# Altium project ADAPTONE_CARTE_DE_SON.PrjPCB (part 3 of 3)

## Sheet StereoHeadphoneDriver.SchDoc
size Tabloid; Size: 11x17; Sheet_Name: Stereo Headphone Driver
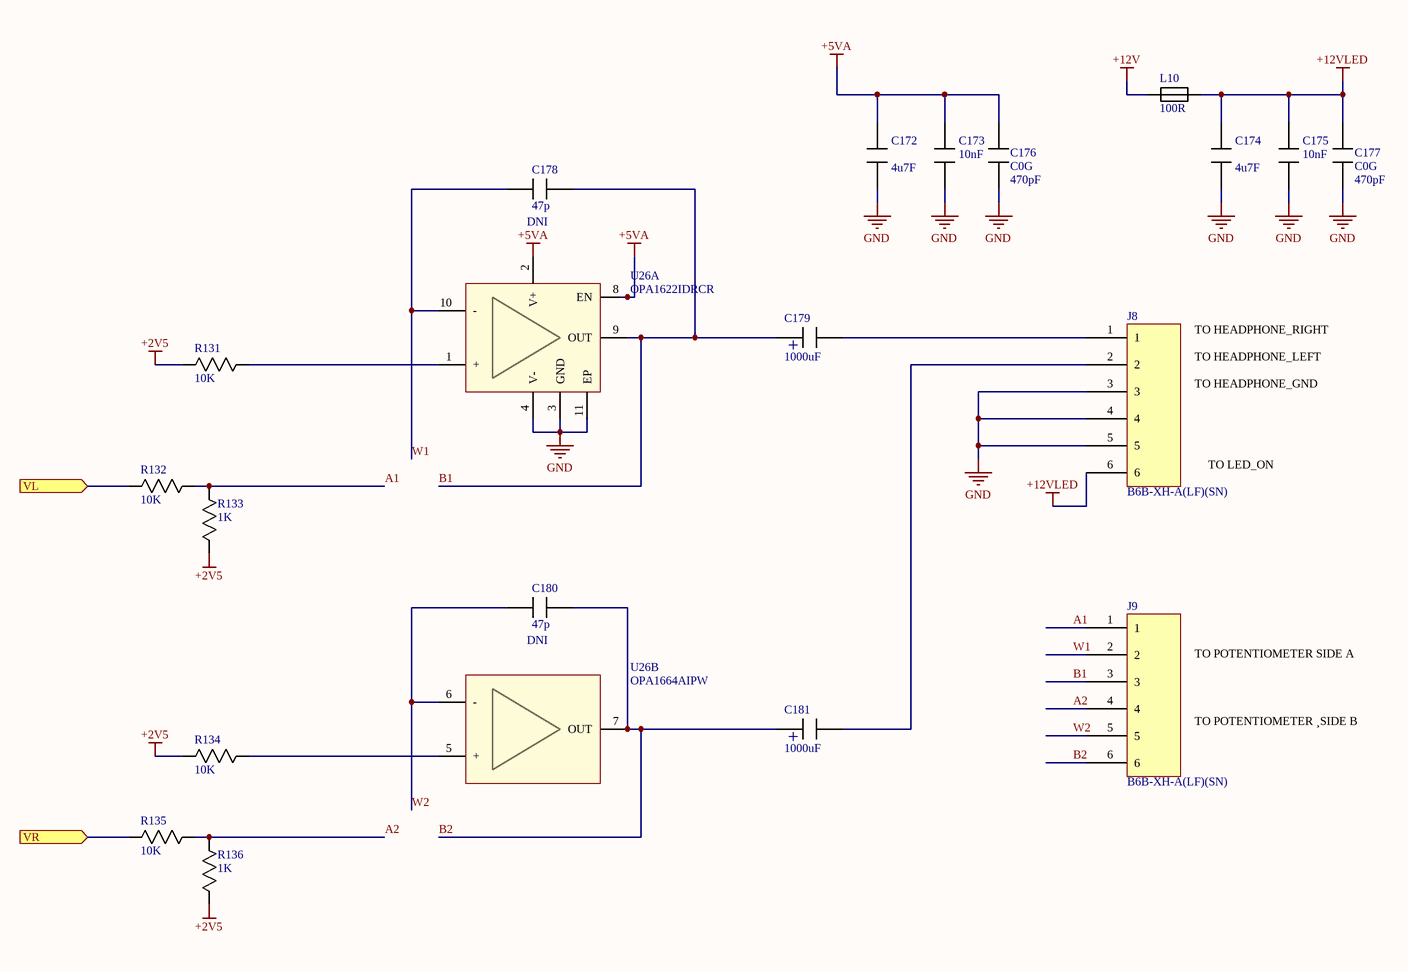
[diagram p12: StereoHeadphoneDriver.SchDoc]

### Parts
C172  value 4u7F  [0805]  (hidden comment: Capacitor)
C173  value 10nF  [0603]  (hidden comment: Capacitor)
C174  value 4u7F  [0805]  (hidden comment: Capacitor)
C175  value 10nF  [0603]  (hidden comment: Capacitor)
C176  value 470pF  Type: C0G  [0603]  (hidden comment: Capacitor)
C177  value 470pF  Type: C0G  [0603]  (hidden comment: Capacitor)
C178  value 47p  note: DNI  [0402]  (hidden comment: Capacitor)
C179  value 1000uF  [CAP_RAD_SMD_DIA315]  (hidden comment: Capacitor_Polarized)
C180  value 47p  note: DNI  [0402]  (hidden comment: Capacitor)
C181  value 1000uF  [CAP_RAD_SMD_DIA315]  (hidden comment: Capacitor_Polarized)
J8  Mfg_PN: B6B-XH-A(LF)(SN)  [CONN_6_HEADER]  (hidden comment: CON_XH_JST_6pins)
J9  Mfg_PN: B6B-XH-A(LF)(SN)  [CONN_6_HEADER]  (hidden comment: CON_XH_JST_6pins)
L10  value 100R  [0603]  (hidden comment: Ferrite)
R131  value 10K  [0402]  (hidden comment: Resistor)
R132  value 10K  [0402]  (hidden comment: Resistor)
R133  value 1K  [0402]  (hidden comment: Resistor)
R134  value 10K  [0402]  (hidden comment: Resistor)
R135  value 10K  [0402]  (hidden comment: Resistor)
R136  value 1K  [0402]  (hidden comment: Resistor)
U26  Mfg_PN: OPA1622IDRCR  [10-VFDFN]  (hidden comment: OPA1622)  (parts A,B of 2)

### Ports
VL (in), VR (in)

### Nets
+2V5: R131.2 R133.2 R134.2 R136.2
+5VA: C172.1 C173.1 C176.2 U26.2(V+) U26.8(EN)
+12V: L10.1
+12VLED: C174.1 C175.1 C177.2 J8.6 L10.2
GND: C172.2 C173.2 C174.2 C175.2 C176.1 C177.1 J8.3 J8.4 J8.5 U26.3(GND) U26.4(V-) U26.11(EP)
A1: J9.1 R132.1 R133.1
A2: J9.4 R135.1 R136.1
B1: C178.2 C179.+ J9.3 U26.9(OUT)
B2: C180.2 C181.+ J9.6 U26.7(OUT)
W1: C178.1 J9.2 U26.10(-)
W2: C180.1 J9.5 U26.6(-)
NetC128.8_2: R132.2 ; port VL
NetC138.8_2: R135.2 ; port VR
NetC179_-: C179.- J8.1
NetC181_-: C181.- J8.2
NetR131_1: R131.1 U26.1(+)
NetR134_1: R134.1 U26.5(+)

### Notes on the sheet
- TO HEADPHONE_RIGHT
- TO HEADPHONE_LEFT
- TO HEADPHONE_GND
- TO LED_ON
- TO POTENTIOMETER SIDE A
- TO POTENTIOMETER ¸SIDE B
- Sheet Name
- Project Title
- Size
- Group
- Revision
- Date :
- Filename :
- Sheet
- Authors :
- of

### Library data of the parts
C172 C174 = Capacitor: Mfg: Samsung; Mfg_PN: CL21A475KAQNNNG; HelpURL: *; NI: *; Supplier1: Digikey; Supplier1_PN: 1276-6462-1-ND; Tolerance: *; Type: *; Rating: *
C173 C175 = Capacitor: Mfg: Murata; Mfg_PN: CL05B103KO5NNNC; HelpURL: *; NI: *; Supplier1: Digikey; Supplier1_PN: 1276-1051-1-ND; Tolerance: *; Type: *; Rating: *
C176 C177 = Capacitor: Mfg: Samsung; Mfg_PN: CL10C471JB8NCNC; HelpURL: *; NI: *; Supplier1: Digikey; Supplier1_PN: 1276-2302-1-ND; Tolerance: *; Rating: *
C178 C180 = Capacitor: Mfg: Murata; Mfg_PN: GRM1885C1H222JA01D; HelpURL: *; NI: *; Supplier1: Digikey; Supplier1_PN: 490-1459-1-ND; Tolerance: *; Type: *; Rating: *
C179 = Capacitor_Polarized_1: Capacitor; Mfg: Nichicon; Mfg_PN: UWT0J102MNL1GS; HelpURL: *; NI: *; Supplier1: Digikey; Supplier1_PN: 493-2160-1-ND; Tolerance: *; Type: *; Rating: *
C181 = Capacitor_Polarized_1: Capacitor; Mfg: Nichicon; Mfg_PN: UWT1E221MNL1GS; HelpURL: *; NI: *; Supplier1: Digikey; Supplier1_PN: 493-2192-1-ND; Tolerance: *; Type: *; Rating: *
J8 J9 = CON_XH_JST_6pins: Mfg: JST Sales America Inc.; Supplier1: Digikey
L10 = Ferrite: Mfg: Bourns; Mfg_PN: MH2029-101Y; Rating: 1A; HelpURL: *; NI: *; Supplier1: Digikey; Supplier1_PN: MH2029-101YCT-ND; Tolerance: *; Type: *
R131-R136 = Resistor: Mfg: Yageo; Mfg_PN: 311-10GRCT-ND; HelpURL: *; NI: *; Supplier1: Digikey; Supplier1_PN: 311-100KGRCT-ND; Type: *; Rating: *; Tolerance: *
U26 = OPA1622: Dual amplifier (headphone driver); Mfg: Texas Instruments; HelpURL: *; NI: *; Rating: *; Supplier1: Digikey; Supplier1_PN: 296-45038-1-ND; Tolerance: *; Value: *

## Sheet PHY_ETHERNET.SchDoc
size Tabloid; DrawnBy: Émile Laplante; Size: 11x17; Sheet_Name: Phy ethernet
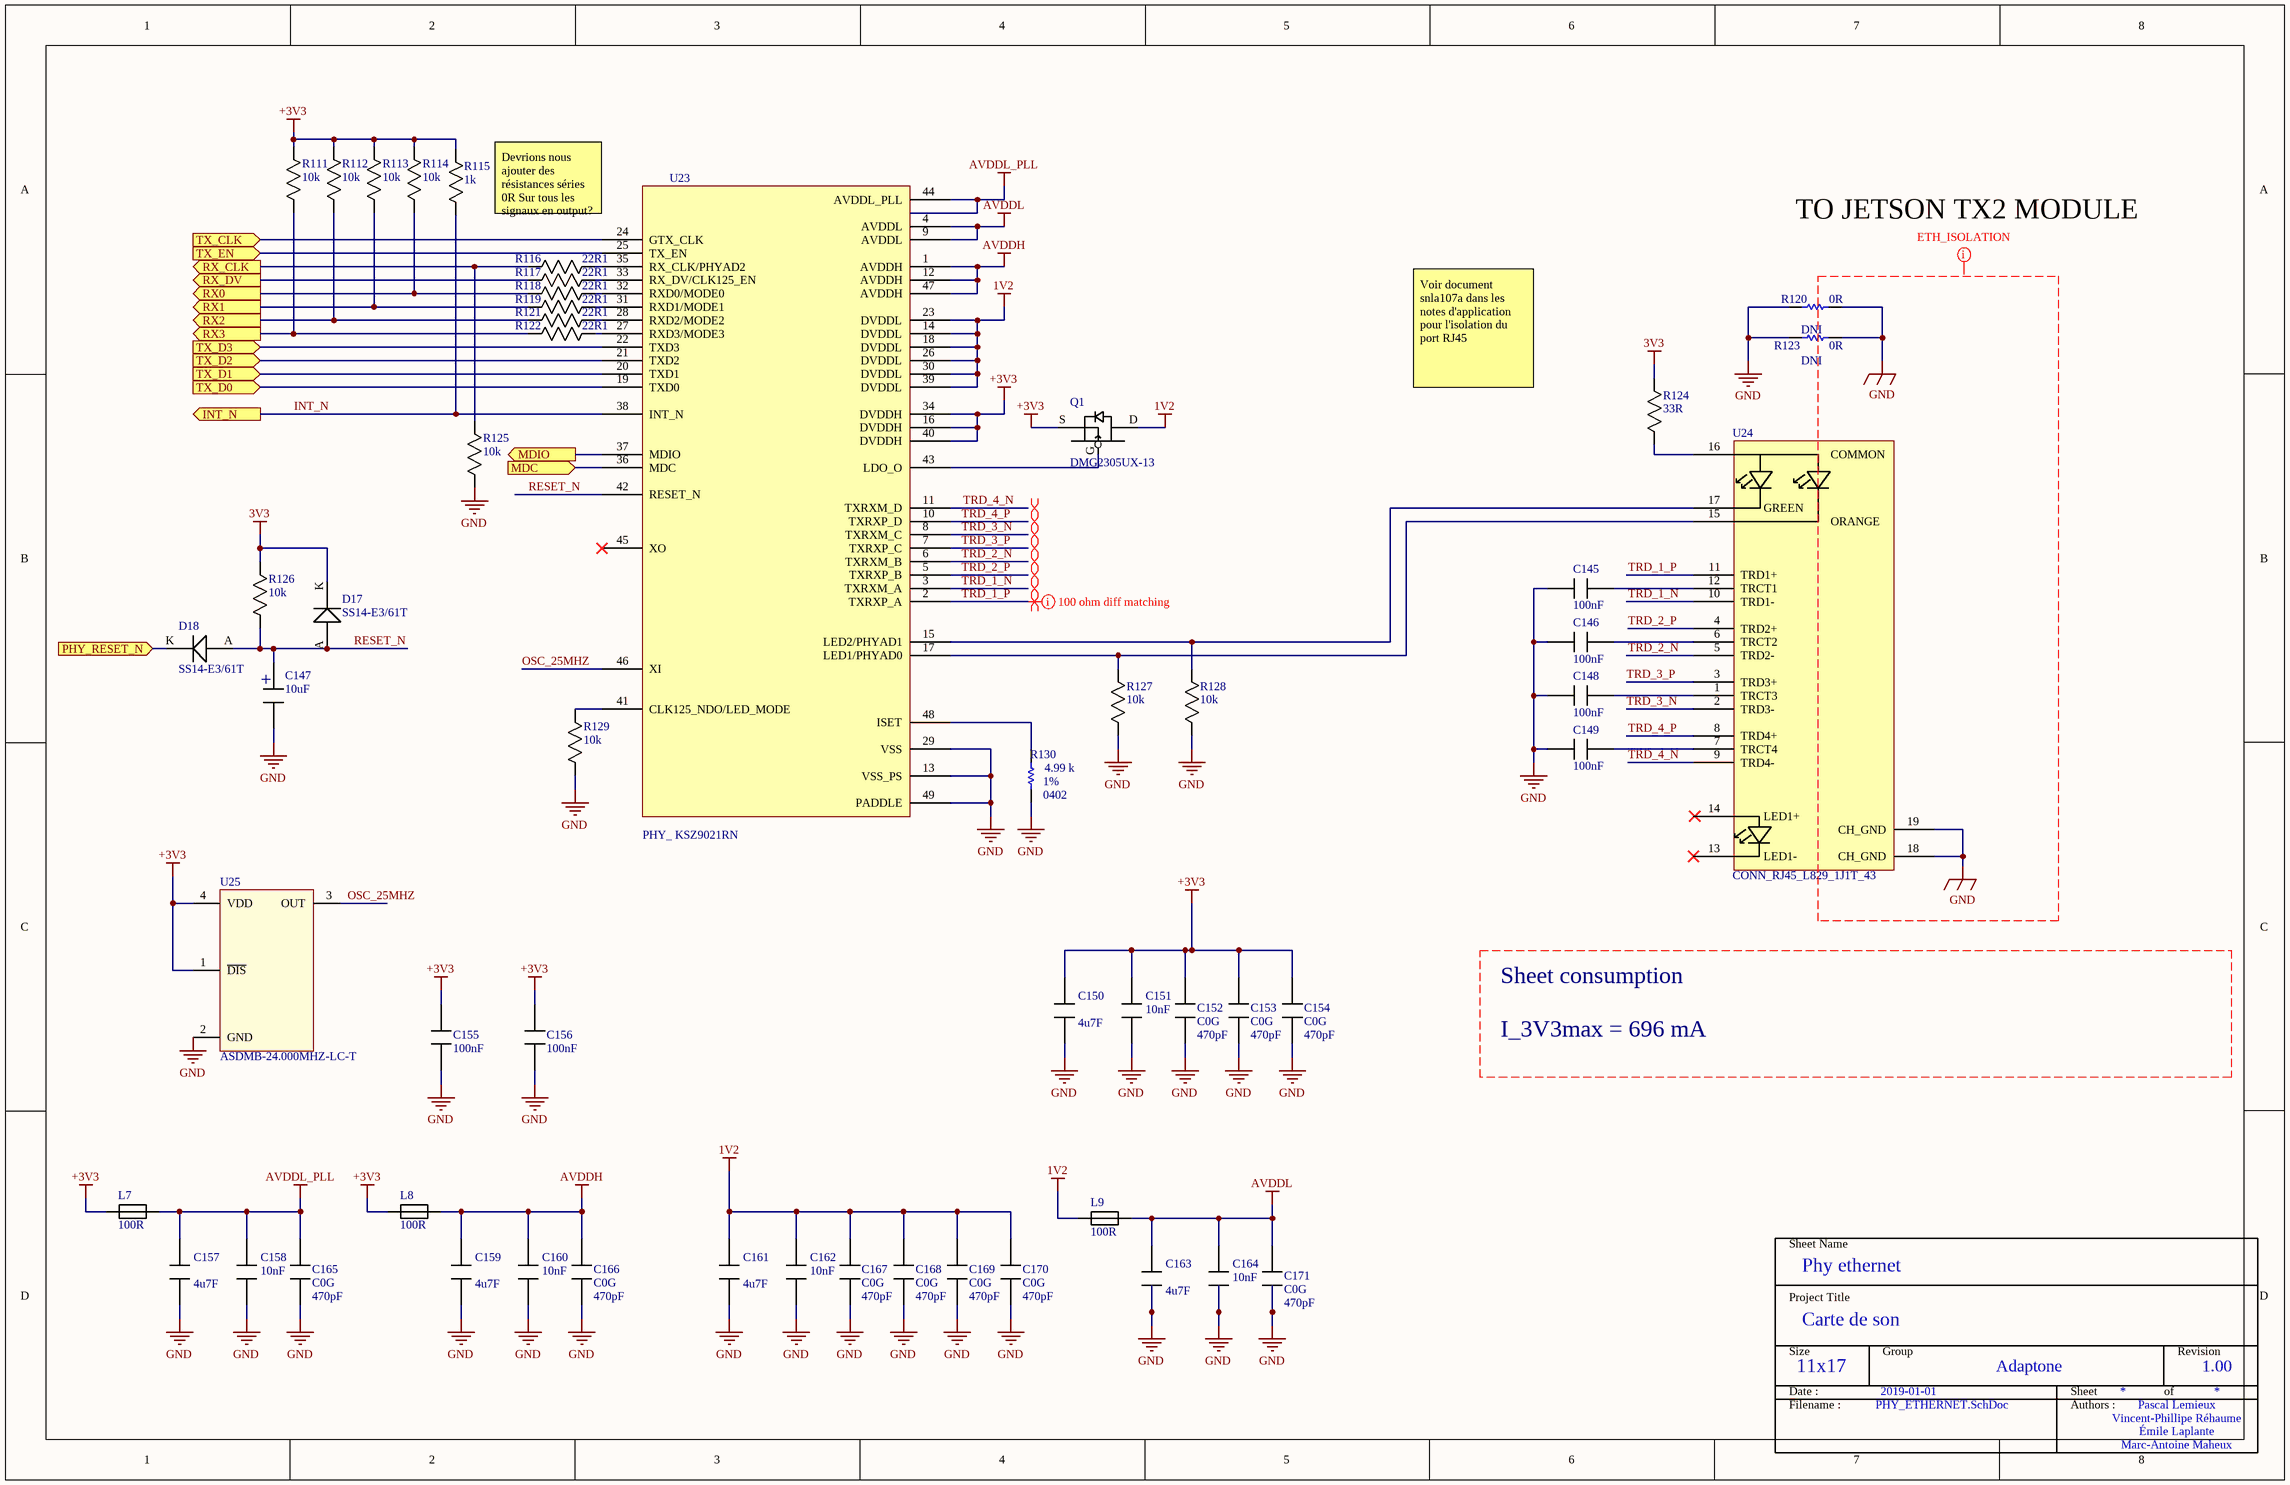
[diagram p13: PHY_ETHERNET.SchDoc]

### Parts
C145  value 100nF  [0603]  (hidden comment: Capacitor)
C146  value 100nF  [0603]  (hidden comment: Capacitor)
C147  value 10uF  [CAP_RAD_SMD_DIA157]  (hidden comment: Capacitor_Polarized)
C148  value 100nF  [0603]  (hidden comment: Capacitor)
C149  value 100nF  [0603]  (hidden comment: Capacitor)
C150  value 4u7F  [0805]  (hidden comment: Capacitor)
C151  value 10nF  [0603]  (hidden comment: Capacitor)
C152  value 470pF  Type: C0G  [0603]  (hidden comment: Capacitor)
C153  value 470pF  Type: C0G  [0603]  (hidden comment: Capacitor)
C154  value 470pF  Type: C0G  [0603]  (hidden comment: Capacitor)
C155  value 100nF  [0603]  (hidden comment: Capacitor)
C156  value 100nF  [0603]  (hidden comment: Capacitor)
C157  value 4u7F  [0805]  (hidden comment: Capacitor)
C158  value 10nF  [0603]  (hidden comment: Capacitor)
C159  value 4u7F  [0805]  (hidden comment: Capacitor)
C160  value 10nF  [0603]  (hidden comment: Capacitor)
C161  value 4u7F  [0805]  (hidden comment: Capacitor)
C162  value 10nF  [0603]  (hidden comment: Capacitor)
C163  value 4u7F  [0805]  (hidden comment: Capacitor)
C164  value 10nF  [0603]  (hidden comment: Capacitor)
C165  value 470pF  Type: C0G  [0603]  (hidden comment: Capacitor)
C166  value 470pF  Type: C0G  [0603]  (hidden comment: Capacitor)
C167  value 470pF  Type: C0G  [0603]  (hidden comment: Capacitor)
C168  value 470pF  Type: C0G  [0603]  (hidden comment: Capacitor)
C169  value 470pF  Type: C0G  [0603]  (hidden comment: Capacitor)
C170  value 470pF  Type: C0G  [0603]  (hidden comment: Capacitor)
C171  value 470pF  Type: C0G  [0603]  (hidden comment: Capacitor)
D17  Mfg_PN: SS14-E3/61T  [DIODE_SMA]  (hidden comment: Diode)
D18  Mfg_PN: SS14-E3/61T  [DIODE_SMA]  (hidden comment: Diode)
L7  value 100R  [0603]  (hidden comment: Ferrite)
L8  value 100R  [0603]  (hidden comment: Ferrite)
L9  value 100R  [0603]  (hidden comment: Ferrite)
Q1  Mfg_PN: DMG2305UX-13  [SOT23_GDS]  (hidden comment: MOSFET_P_GDS)
R111  value 10k  [0603]  (hidden comment: Resistor)
R112  value 10k  [0603]  (hidden comment: Resistor)
R113  value 10k  [0603]  (hidden comment: Resistor)
R114  value 10k  [0603]  (hidden comment: Resistor)
R115  value 1k  [0603]  (hidden comment: Resistor)
R116  value 22R1  [0402]  (hidden comment: Resistor)
R117  value 22R1  [0402]  (hidden comment: Resistor)
R118  value 22R1  [0402]  (hidden comment: Resistor)
R119  value 22R1  [0402]  (hidden comment: Resistor)
R120  value 0R  Specification: DNI  [RES_1206]  (hidden comment: RES - 1206)
R121  value 22R1  [0402]  (hidden comment: Resistor)
R122  value 22R1  [0402]  (hidden comment: Resistor)
R123  value 0R  Specification: DNI  [RES_1206]  (hidden comment: RES - 1206)
R124  value 33R  [0603]  (hidden comment: Resistor)
R125  value 10k  [0603]  (hidden comment: Resistor)
R126  value 10k  [0603]  (hidden comment: Resistor)
R127  value 10k  [0603]  (hidden comment: Resistor)
R128  value 10k  [0603]  (hidden comment: Resistor)
R129  value 10k  [0603]  (hidden comment: Resistor)
R130  value 4.99 k  Package: 0402  Precision: 1%  [RES_0402]  (hidden comment: RES - 0402)
U23  PHY_ KSZ9021RN  [PHY_KSZ9021RN]
U24  CONN_RJ45_L829_1J1T_43  [L829-1J1T-43]
U25  Mfg_PN: ASDMB-24.000MHZ-LC-T  [OSC_ADSMB]  (hidden comment: OSC_ASDMB)

### Ports
INT_N (out), MDC (in), MDIO (out), PHY_RESET_N (in), RX0 (out), RX1 (out), RX2 (out), RX3 (out), RX_CLK (out), RX_DV (out), TX_CLK (in), TX_D0 (in), TX_D1 (in), TX_D2 (in), TX_D3 (in), TX_EN (in)

### Nets
1V2: C161.1 C162.1 C167.2 C168.2 C169.2 C170.2 L9.1 Q1.D U23.14(DVDDL) U23.18(DVDDL) U23.23(DVDDL) U23.26(DVDDL) U23.30(DVDDL) U23.39(DVDDL)
3V3: D17.K R124.2 R126.2
+3V3: C150.1 C151.1 C152.2 C153.2 C154.2 C155.1 C156.1 L7.1 L8.1 Q1.S R111.1 R112.1 R113.1 R114.1 R115.2 U23.16(DVDDH) U23.34(DVDDH) U23.40(DVDDH) U25.1(~{DIS}) U25.4(VDD)
AVDDH: C159.1 C160.1 C166.2 L8.2 U23.1(AVDDH) U23.12(AVDDH) U23.47(AVDDH)
AVDDL: C163.1 C164.1 C171.2 L9.2 U23.4(AVDDL) U23.9(AVDDL)
AVDDL_PLL: C157.1 C158.1 C165.2 L7.2 U23.44(AVDDL_PLL)
GND: C145.2 C146.2 C147.- C148.2 C149.2 C150.2 C151.2 C152.1 C153.1 C154.1 C155.2 C156.2 C157.2 C158.2 C159.2 C160.2 C161.2 C162.2 C163.2 C164.2 C165.1 C166.1 C167.1 C168.1 C169.1 C170.1 C171.1 R120.1 R120.2 R123.1 R123.2 R125.2 R127.2 R128.2 R129.2 R130.1 U23.13(VSS_PS) U23.29(VSS) U23.49(PADDLE) U24.18(CH_GND) U24.19(CH_GND) U25.2(GND)
INT_N: R115.1 U23.38(INT_N) ; port INT_N
OSC_25MHZ: U23.46(XI) U25.3(OUT)
PHY_MDC: U23.36(MDC) ; port MDC
PHY_MDIO: U23.37(MDIO) ; port MDIO
PHY_RESET_N: D18.K ; port PHY_RESET_N
PHY_RX0: R114.2 R118.1 ; port RX0
PHY_RX1: R113.2 R119.1 ; port RX1
PHY_RX2: R112.2 R121.1 ; port RX2
PHY_RX3: R111.2 R122.1 ; port RX3
PHY_RX_CLK: R116.1 R125.1 ; port RX_CLK
PHY_RX_DV: R117.1 ; port RX_DV
PHY_TX_CLK: U23.24(GTX_CLK) ; port TX_CLK
PHY_TX_D0: U23.19(TXD0) ; port TX_D0
PHY_TX_D1: U23.20(TXD1) ; port TX_D1
PHY_TX_D3: U23.22(TXD3) ; port TX_D3
PHY_TX_EN: U23.25(TX_EN) ; port TX_EN
PHY_TXD2: U23.21(TXD2) ; port TX_D2
RESET_N: C147.+ D17.A D18.A R126.1 U23.42(RESET_N)
TRD_1_N: U23.3(TXRXM_A) U24.10(TRD1-)
TRD_1_P: U23.2(TXRXP_A) U24.11(TRD1+)
TRD_2_N: U23.6(TXRXM_B) U24.5(TRD2-)
TRD_2_P: U23.5(TXRXP_B) U24.4(TRD2+)
TRD_3_N: U23.8(TXRXM_C) U24.2(TRD3-)
TRD_3_P: U23.7(TXRXP_C) U24.3(TRD3+)
TRD_4_N: U23.11(TXRXM_D) U24.9(TRD4-)
TRD_4_P: U23.10(TXRXP_D) U24.8(TRD4+)
NetC145_1: C145.1 U24.12(TRCT1)
NetC146_1: C146.1 U24.6(TRCT2)
NetC148_1: C148.1 U24.1(TRCT3)
NetC149_1: C149.1 U24.7(TRCT4)
NetQ1_G: Q1.G U23.43(LDO_O)
NetR116_2: R116.2 U23.35(RX_CLK/PHYAD2)
NetR117_2: R117.2 U23.33(RX_DV/CLK125_EN)
NetR118_2: R118.2 U23.32(RXD0/MODE0)
NetR119_2: R119.2 U23.31(RXD1/MODE1)
NetR121_2: R121.2 U23.28(RXD2/MODE2)
NetR122_2: R122.2 U23.27(RXD3/MODE3)
NetR124_1: R124.1 U24.16(COMMON)
NetR127_1: R127.1 U23.17(LED1/PHYAD0) U24.15(ORANGE)
NetR128_1: R128.1 U23.15(LED2/PHYAD1) U24.17(GREEN)
NetR129_1: R129.1 U23.41(CLK125_NDO/LED_MODE)
NetR130_2: R130.2 U23.48(ISET)

Not connected (* = marked no-connect by the designer): U23 45(XO)*; U24 13(LED1-)* 14(LED1+)

### Layout directives
differential pair: TRD_1_N, TRD_1_P, TRD_2_N, TRD_2_P, TRD_3_N, TRD_3_P, TRD_4_N, TRD_4_P
net class TO JETSON TX2 MODULE: GND
rule Undefined: TRD_1_P

### Notes on the sheet
- Devrions nous ajouter des résistances séries 0R Sur tous les signaux en output?
- Voir document snla107a dans les notes d'application pour l'isolation du port RJ45
- Sheet consumption
- I_3V3max = 696 mA
- Sheet Name
- Project Title
- Size
- Group
- Revision
- Date :
- Filename :
- Sheet
- Authors :
- of

### Library data of the parts
C145 C146 C148 C149 C155 C156 = Capacitor: Mfg: Samsung; Mfg_PN: CL10F104ZO8NNNC; HelpURL: *; Supplier1: Digikey; Supplier1_PN: 1276-1258-1-ND; Tolerance: *; Type: *; Rating: *
  C145 C146 C148 C149: NI: NI
  C155 C156: NI: *
C147 = Capacitor_Polarized: Capacitor; Mfg: Nichicon; Mfg_PN: UWX1C100MCL1GB; HelpURL: *; NI: *; Supplier1: Digikey; Supplier1_PN: 493-2100-1-ND; Tolerance: *; Type: *; Rating: *
C150 C157 C159 C161 C163 = Capacitor: Mfg: Samsung; Mfg_PN: CL21A475KAQNNNG; HelpURL: *; NI: *; Supplier1: Digikey; Supplier1_PN: 1276-6462-1-ND; Tolerance: *; Type: *; Rating: *
C151 C158 C160 C162 C164 = Capacitor: Mfg: Murata; Mfg_PN: CL05B103KO5NNNC; HelpURL: *; NI: *; Supplier1: Digikey; Supplier1_PN: 1276-1051-1-ND; Tolerance: *; Type: *; Rating: *
C152-C154 C165-C171 = Capacitor: Mfg: Samsung; Mfg_PN: CL10C471JB8NCNC; HelpURL: *; NI: *; Supplier1: Digikey; Supplier1_PN: 1276-2302-1-ND; Tolerance: *; Rating: *
D17 D18 = Diode: Mfg: Vishay; HelpURL: *; NI: *; Supplier1: Digikey; Supplier1_PN: SS14-E3/61TGICT-ND; Tolerance: *; Type: *; Rating: *; Value: *
L7-L9 = Ferrite: as L10 on sheet StereoHeadphoneDriver; HelpURL: *; NI: *; Supplier1: Digikey; Supplier1_PN: MH2029-101YCT-ND; Tolerance: *; Type: *
Q1 = MOSFET_P_GDS: PMOS; Mfg: Diodes Incorporated; HelpURL: *; NI: *; Rating: *; Supplier1: Digikey; Supplier1_PN: DMG2305UX-13DICT-ND; Tolerance: *; Type: *; Value: *
R111-R114 R125-R129 = Resistor: Mfg: Yageo; Mfg_PN: RC0603JR-0710KL; HelpURL: *; NI: *; Supplier1: Digikey; Supplier1_PN: 311-10KGRCT-ND; Type: *; Rating: *; Tolerance: *
R115 = Resistor: Mfg: Yageo; Mfg_PN: RC0603JR-071KL; HelpURL: *; NI: *; Supplier1: Digikey; Supplier1_PN: 311-1.0KGRCT-ND; Type: *; Rating: *; Tolerance: *
R116-R119 R121 R122 = Resistor: Mfg: Yageo; Mfg_PN: RC0402FR-0722R1L; HelpURL: *; NI: *; Supplier1: Digikey; Supplier1_PN: 311-22.1LRCT-ND; Type: *; Rating: *; Tolerance: *
R120 R123 = RES - 1206: Mfg Part Number: RMCF1206ZT0R00; Mfg: Stackpole Electronics Inc; Precision: 1%; Current: *; HelpURL: https://www.digikey.ca/product-detail/en/stackpole-electronics-inc/RMCF1206ZT0R00/RMCF1206ZT0R00TR-ND/1756906; CreatedBy: Jonathan Bouchard; Package: 1206
R124 = Resistor: Mfg: Yageo; Mfg_PN: RC0603JR-0733RL; HelpURL: *; NI: *; Supplier1: Digikey; Supplier1_PN: 311-33GRCT-ND; Type: *; Rating: *; Tolerance: *
R130 = RES - 0402: Mfg Part Number: RC0402FR-074K99L; Suplier Part Number: 311-4.99KLRCT-ND; Mfg: Yageo; Power: 1/16W; Current: *; HelpURL: https://www.digikey.ca/product-detail/en/yageo/RC0402FR-074K99L/311-4.99KLRCT-ND/2827886; CreatedBy: Jonathan Bouchard; Supplier: Digikey
U23 = PHY_ KSZ9021RN: Mfg: Microchip Technology; CreatedBy: Emile Laplante; HelpURL: https://www.digikey.ca/product-detail/en/microchip-technology/KSZ9021RN/576-3637-ND/2184487; Mfg Part Number: KSZ9021RN; NI: *; Package: 48-VFQFN Exposed Pad; Power: *; Supplier: Digikey; Supplier Part Numer: 576-3637-ND; Temperature: *; Value: *; VerifiedBy: *; Voltage: *
U24 = CONN_RJ45_L829_1J1T_43: Mfg: Bel Fuse Inc.; CreatedBy: Emile Laplante; HelpURL: https://www.digikey.ca/products/en?keywords=L829-1J1T-43; Mfg Part Number: L829-1J1T-43; NI: *; Package: RJ45; Power: *; Supplier: Digikey; Supplier Part Numer: 380-1110-ND; Temperature: *; Value: *; VerifiedBy: *; Voltage: *
U25 = OSC_ASDMB: Oscillator; 1V8 to 3V3; Mfg: Abracon; HelpURL: http://www.abracon.com/Oscillators/ASDMB.pdf; Supplier1: Digikey; Supplier1_PN: 535-11728-1-ND; NI: *; Type: 24MHz

## Sheet U_LEDs_I2C_PORT.SchDoc
size Tabloid; DocumentNumber: 9; SheetNumber: 9; SheetTotal: 11; SheetName: LEDs and I2C exp. connector; Size: 11x17; Sheet_Name: LEDs and I2C exp. connector
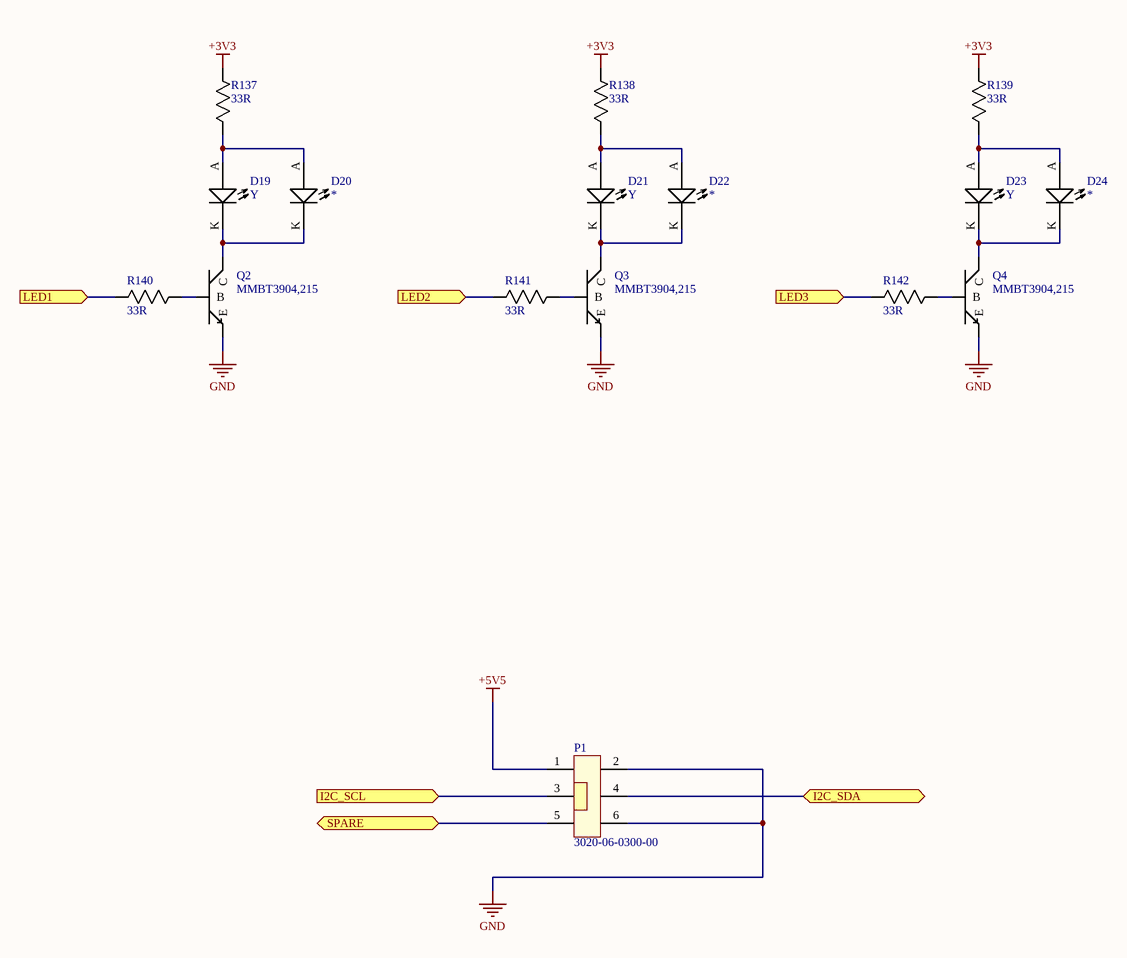
[diagram p14: U_LEDs_I2C_PORT.SchDoc]

### Parts
D19  Type: Y  [0805_LED]  (hidden comment: Diode_LED)
D20  Diode_LED  [0805_LED]  (value not drawn)
D21  Type: Y  [0805_LED]  (hidden comment: Diode_LED)
D22  Diode_LED  [0805_LED]  (value not drawn)
D23  Type: Y  [0805_LED]  (hidden comment: Diode_LED)
D24  Diode_LED  [0805_LED]  (value not drawn)
P1  Mfg_PN: 3020-06-0300-00  [CONN6_100mils_pol_SMD]  (hidden comment: CON6_3020-06-0300-00)
Q2  Mfg_PN: MMBT3904,215  [SOT23_GDS]  (hidden comment: BJT_N_GDS)
Q3  Mfg_PN: MMBT3904,215  [SOT23_GDS]  (hidden comment: BJT_N_GDS)
Q4  Mfg_PN: MMBT3904,215  [SOT23_GDS]  (hidden comment: BJT_N_GDS)
R137  value 33R  [0603]  (hidden comment: Resistor)
R138  value 33R  [0603]  (hidden comment: Resistor)
R139  value 33R  [0603]  (hidden comment: Resistor)
R140  value 33R  [0603]  (hidden comment: Resistor)
R141  value 33R  [0603]  (hidden comment: Resistor)
R142  value 33R  [0603]  (hidden comment: Resistor)

### Ports
I2C_SCL (in), I2C_SDA (bidir), LED1 (in), LED2 (in), LED3 (in), SPARE (bidir)

### Nets
+3V3: R137.2 R138.2 R139.2
+5V5: P1.1
GND: P1.2 P1.6 Q2.S(E) Q3.S(E) Q4.S(E)
I2C_SCL: P1.3 ; port I2C_SCL
I2C_SDA: P1.4 ; port I2C_SDA
NetD19_A: D19.A D20.A R137.1
NetD19_K: D19.K D20.K Q2.D(C)
NetD21_A: D21.A D22.A R138.1
NetD21_K: D21.K D22.K Q3.D(C)
NetD23_A: D23.A D24.A R139.1
NetD23_K: D23.K D24.K Q4.D(C)
NetP1_5: P1.5 ; port SPARE
NetQ2_G: Q2.G(B) R140.2
NetQ3_G: Q3.G(B) R141.2
NetQ4_G: Q4.G(B) R142.2
NetR140_1: R140.1 ; port LED1
NetR141_1: R141.1 ; port LED2
NetR142_1: R142.1 ; port LED3

### Notes on the sheet
- Sheet Name
- Project Title
- Size
- Group
- Revision
- Date :
- Filename :
- Sheet
- Authors :
- of

### Library data of the parts
D19 D21 D23 = Diode_LED: LED; Mfg: Osram; Mfg_PN: LY R976-PS-36; HelpURL: *; NI: *; Supplier1: Digikey; Supplier1_PN: 475-2560-1-ND; Tolerance: *; Rating: *; Value: *
D20 D22 D24 = Diode_LED: LED; Mfg: Osram; Mfg_PN: LY R976-PS-36; Type: Y; HelpURL: *; NI: *; Supplier1: Digikey; Supplier1_PN: 475-2560-1-ND; Tolerance: *; Rating: *; Value: *
P1 = CON6_3020-06-0300-00: 6-pins; Mfg: Harwin; HelpURL: *; NI: *; Rating: *; Supplier1: Digikey; Supplier1_PN: 3020-06-0300-00-ND; Tolerance: *; Type: *; Value: *
Q2-Q4 = BJT_N_GDS: BJT NPN; Mfg: NXP; HelpURL: *; NI: *; Rating: *; Supplier1: Digikey; Supplier1_PN: 568-4510-1-ND; Tolerance: *; Type: *; Value: *
R137-R142 = Resistor: Mfg: Yageo; Mfg_PN: RC0603JR-0733RL; HelpURL: *; NI: *; Supplier1: Digikey; Supplier1_PN: 311-33GRCT-ND; Type: *; Rating: *; Tolerance: *

## Nets that join several sheets
+1V0: TopLevel (TP15.1 TP15.2), XMOS_power (33 pins)
+2V5: TopLevel (TP11.1 TP11.2), Power (C11.1 C13.2 U5.1), AUDIO INPUTS/U_InputsConnectors/U_InputAmplifier (20 pins), AUDIO INPUTS/U_InputsConnectors/U_InputAmplifier (20 pins), AUDIO INPUTS/U_InputsConnectors/U_InputAmplifier (20 pins), AUDIO INPUTS/U_InputsConnectors/U_InputAmplifier (20 pins), AUDIO INPUTS/U_InputsConnectors/U_InputAmplifier (20 pins), AUDIO INPUTS/U_InputsConnectors/U_InputAmplifier (20 pins), AUDIO INPUTS/U_InputsConnectors/U_InputAmplifier (20 pins), AUDIO INPUTS/U_InputsConnectors/U_InputAmplifier (20 pins), AUDIO INPUTS/U_InputsConnectors/U_InputAmplifier (20 pins), AUDIO INPUTS/U_InputsConnectors/U_InputAmplifier (20 pins), AUDIO INPUTS/U_InputsConnectors/U_InputAmplifier (20 pins), AUDIO INPUTS/U_InputsConnectors/U_InputAmplifier (20 pins), AUDIO INPUTS/U_InputsConnectors/U_InputAmplifier (20 pins), AUDIO INPUTS/U_InputsConnectors/U_InputAmplifier (20 pins), AUDIO INPUTS/U_InputsConnectors/U_InputAmplifier (20 pins), AUDIO INPUTS/U_InputsConnectors/U_InputAmplifier (20 pins), U_AudioOutputs_16/U_OutputConnectors (10 pins), U_AudioOutputs_16/U_OutputConnectors (10 pins), U_AudioOutputs_16/U_OutputConnectors (10 pins), U_AudioOutputs_16/U_OutputConnectors (10 pins), U_AudioOutputs_16/U_OutputConnectors (10 pins), U_AudioOutputs_16/U_OutputConnectors (10 pins), U_AudioOutputs_16/U_OutputConnectors (10 pins), U_AudioOutputs_16/U_OutputConnectors (10 pins), StereoHeadphoneDriver (R131.2 R133.2 R134.2 R136.2)
+3V3: TopLevel (TP12.1 TP12.2), XMOS_chip (R22.1 R23.1 R24.1), XMOS_power (32 pins), Clock (5 pins), ADC1 (8 pins), DAC2 (7 pins), AudioInputs_16 (32 pins), DAC1 (6 pins), ADC2 (7 pins), PHY_ETHERNET (20 pins), U_LEDs_I2C_PORT (R137.2 R138.2 R139.2)
+5V5: TopLevel (TP16.1 TP16.2), Power (9 pins), XMOS_power (C83.1 U17.4 U17.5), ADC1 (7 pins), ADC2 (7 pins), U_LEDs_I2C_PORT (P1.1)
+5VA: TopLevel (TP13.1 TP13.2), Power (5 pins), DAC2 (C117.1.1 C118.1.1 U21.1.32), AudioInputs_16 (12 pins), AUDIO INPUTS/U_InputsConnectors/U_InputAmplifier (11 pins), AUDIO INPUTS/U_InputsConnectors/U_InputAmplifier (11 pins), AUDIO INPUTS/U_InputsConnectors/U_InputAmplifier (11 pins), AUDIO INPUTS/U_InputsConnectors/U_InputAmplifier (11 pins), AUDIO INPUTS/U_InputsConnectors/U_InputAmplifier (11 pins), AUDIO INPUTS/U_InputsConnectors/U_InputAmplifier (11 pins), AUDIO INPUTS/U_InputsConnectors/U_InputAmplifier (11 pins), AUDIO INPUTS/U_InputsConnectors/U_InputAmplifier (11 pins), AUDIO INPUTS/U_InputsConnectors/U_InputAmplifier (11 pins), AUDIO INPUTS/U_InputsConnectors/U_InputAmplifier (11 pins), AUDIO INPUTS/U_InputsConnectors/U_InputAmplifier (11 pins), AUDIO INPUTS/U_InputsConnectors/U_InputAmplifier (11 pins), AUDIO INPUTS/U_InputsConnectors/U_InputAmplifier (11 pins), AUDIO INPUTS/U_InputsConnectors/U_InputAmplifier (11 pins), AUDIO INPUTS/U_InputsConnectors/U_InputAmplifier (11 pins), AUDIO INPUTS/U_InputsConnectors/U_InputAmplifier (11 pins), DAC1 (C117.2.1 C118.2.1 U21.2.32), U_AudioOutputs_16/U_OutputConnectors (8 pins), U_AudioOutputs_16/U_OutputConnectors (8 pins), U_AudioOutputs_16/U_OutputConnectors (8 pins), U_AudioOutputs_16/U_OutputConnectors (8 pins), U_AudioOutputs_16/U_OutputConnectors (8 pins), U_AudioOutputs_16/U_OutputConnectors (8 pins), U_AudioOutputs_16/U_OutputConnectors (8 pins), U_AudioOutputs_16/U_OutputConnectors (8 pins), StereoHeadphoneDriver (5 pins)
+12V0: Power (11 pins), XMOS_power (C86.+ C87.+ R68.2 U18.2), AUDIO INPUTS/U_InputsConnectors (J7.1.5 J7.1.6), AUDIO INPUTS/U_InputsConnectors (J7.2.5 J7.2.6), AUDIO INPUTS/U_InputsConnectors (J7.3.5 J7.3.6), AUDIO INPUTS/U_InputsConnectors (J7.4.5 J7.4.6), AUDIO INPUTS/U_InputsConnectors (J7.5.5 J7.5.6), AUDIO INPUTS/U_InputsConnectors (J7.6.5 J7.6.6), AUDIO INPUTS/U_InputsConnectors (J7.7.5 J7.7.6), AUDIO INPUTS/U_InputsConnectors (J7.8.5 J7.8.6)
+48V0: TopLevel (TP14.1 TP14.2), Power (5 pins), AUDIO INPUTS/U_InputsConnectors (J7.1.3), AUDIO INPUTS/U_InputsConnectors (J7.2.3), AUDIO INPUTS/U_InputsConnectors (J7.3.3), AUDIO INPUTS/U_InputsConnectors (J7.4.3), AUDIO INPUTS/U_InputsConnectors (J7.5.3), AUDIO INPUTS/U_InputsConnectors (J7.6.3), AUDIO INPUTS/U_InputsConnectors (J7.7.3), AUDIO INPUTS/U_InputsConnectors (J7.8.3)
GND: TopLevel (6 pins), Power (44 pins), XMOS_chip (13 pins), XMOS_power (48 pins), Clock (5 pins), ADC1 (23 pins), DAC2 (25 pins), AudioInputs_16 (28 pins), AUDIO INPUTS/U_InputsConnectors (J6.1.4 J7.1.4), AUDIO INPUTS/U_InputsConnectors/U_InputAmplifier (14 pins), AUDIO INPUTS/U_InputsConnectors/U_InputAmplifier (14 pins), AUDIO INPUTS/U_InputsConnectors (J6.2.4 J7.2.4), AUDIO INPUTS/U_InputsConnectors/U_InputAmplifier (14 pins), AUDIO INPUTS/U_InputsConnectors/U_InputAmplifier (14 pins), AUDIO INPUTS/U_InputsConnectors (J6.3.4 J7.3.4), AUDIO INPUTS/U_InputsConnectors/U_InputAmplifier (14 pins), AUDIO INPUTS/U_InputsConnectors/U_InputAmplifier (14 pins), AUDIO INPUTS/U_InputsConnectors (J6.4.4 J7.4.4), AUDIO INPUTS/U_InputsConnectors/U_InputAmplifier (14 pins), AUDIO INPUTS/U_InputsConnectors/U_InputAmplifier (14 pins), AUDIO INPUTS/U_InputsConnectors (J6.5.4 J7.5.4), AUDIO INPUTS/U_InputsConnectors/U_InputAmplifier (14 pins), AUDIO INPUTS/U_InputsConnectors/U_InputAmplifier (14 pins), AUDIO INPUTS/U_InputsConnectors (J6.6.4 J7.6.4), AUDIO INPUTS/U_InputsConnectors/U_InputAmplifier (14 pins), AUDIO INPUTS/U_InputsConnectors/U_InputAmplifier (14 pins), AUDIO INPUTS/U_InputsConnectors (J6.7.4 J7.7.4), AUDIO INPUTS/U_InputsConnectors/U_InputAmplifier (14 pins), AUDIO INPUTS/U_InputsConnectors/U_InputAmplifier (14 pins), AUDIO INPUTS/U_InputsConnectors (J6.8.4 J7.8.4), AUDIO INPUTS/U_InputsConnectors/U_InputAmplifier (14 pins), AUDIO INPUTS/U_InputsConnectors/U_InputAmplifier (14 pins), DAC1 (26 pins), ADC2 (24 pins), U_AudioOutputs_16/U_OutputConnectors (15 pins), U_AudioOutputs_16/U_OutputConnectors (15 pins), U_AudioOutputs_16/U_OutputConnectors (15 pins), U_AudioOutputs_16/U_OutputConnectors (15 pins), U_AudioOutputs_16/U_OutputConnectors (15 pins), U_AudioOutputs_16/U_OutputConnectors (15 pins), U_AudioOutputs_16/U_OutputConnectors (15 pins), U_AudioOutputs_16/U_OutputConnectors (15 pins), StereoHeadphoneDriver (12 pins), PHY_ETHERNET (42 pins), U_LEDs_I2C_PORT (5 pins)
ADC1_SDOUT1: XMOS_chip (U8.88), ADC1 (R32.1.2)
ADC1_SDOUT2: XMOS_chip (U8.89), ADC1 (R33.1.2)
ADC1_SDOUT3: XMOS_chip (U8.62), ADC1 (R34.1.2)
ADC1_SDOUT4: XMOS_chip (U8.90), ADC1 (R35.1.2)
ADC2_SDOUT1: XMOS_chip (U8.4), ADC2 (R32.2.2)
ADC2_SDOUT2: XMOS_chip (U8.5), ADC2 (R33.2.2)
ADC2_SDOUT3: XMOS_chip (U8.3), ADC2 (R34.2.2)
ADC2_SDOUT4: XMOS_chip (U8.7), ADC2 (R35.2.2)
AOUT1: DAC1 (U21.2.39), U_AudioOutputs_16/U_OutputConnectors (C134.1.1)
AOUT2: DAC1 (U21.2.38), U_AudioOutputs_16/U_OutputConnectors (C141.1.1)
AOUT3: DAC1 (U21.2.35), U_AudioOutputs_16/U_OutputConnectors (C134.2.1)
AOUT4: DAC1 (U21.2.34), U_AudioOutputs_16/U_OutputConnectors (C141.2.1)
AOUT5: DAC1 (U21.2.29), U_AudioOutputs_16/U_OutputConnectors (C134.3.1)
AOUT6: DAC1 (U21.2.28), U_AudioOutputs_16/U_OutputConnectors (C141.3.1)
AOUT7: DAC1 (U21.2.25), U_AudioOutputs_16/U_OutputConnectors (C134.4.1)
AOUT8: DAC1 (U21.2.24), U_AudioOutputs_16/U_OutputConnectors (C141.4.1)
AOUT9: DAC2 (U21.1.39), U_AudioOutputs_16/U_OutputConnectors (C134.5.1)
AOUT10: DAC2 (U21.1.38), U_AudioOutputs_16/U_OutputConnectors (C141.5.1)
AOUT11: DAC2 (U21.1.35), U_AudioOutputs_16/U_OutputConnectors (C134.6.1)
AOUT12: DAC2 (U21.1.34), U_AudioOutputs_16/U_OutputConnectors (C141.6.1)
AOUT13: DAC2 (U21.1.29), U_AudioOutputs_16/U_OutputConnectors (C134.7.1)
AOUT14: DAC2 (U21.1.28), U_AudioOutputs_16/U_OutputConnectors (C141.7.1)
AOUT15: DAC2 (U21.1.25), U_AudioOutputs_16/U_OutputConnectors (C134.8.1)
AOUT16: DAC2 (U21.1.24), U_AudioOutputs_16/U_OutputConnectors (C141.8.1)
BCLK: XMOS_chip (U8.27), DAC2 (R81.1.1), DAC1 (R81.2.1)
DAC1_SDIN1_TDM: XMOS_chip (U8.28), DAC1 (R82.2.1)
DAC2_SDIN1_TDM: XMOS_chip (U8.32), DAC2 (R82.1.1)
FSYNC: XMOS_chip (U8.91), DAC2 (R80.1.1), DAC1 (R80.2.1)
I2C_SCL: TopLevel (TP1.1 TP1.2), XMOS_chip (R23.2 U8.37), Clock (U1.9), ADC1 (U10.1.39), DAC2 (U21.1.15), AudioInputs_16 (U11.17 U12.17 U13.17 U14.17), DAC1 (U21.2.15), ADC2 (U10.2.39), U_LEDs_I2C_PORT (P1.3)
I2C_SDA: TopLevel (TP2.1 TP2.2), XMOS_chip (R22.2 U8.38), Clock (U1.10), ADC1 (U10.1.40), DAC2 (U21.1.16), AudioInputs_16 (U11.19 U12.19 U13.19 U14.19), DAC1 (U21.2.16), ADC2 (U10.2.40), U_LEDs_I2C_PORT (P1.4)
IN1_N: ADC1 (U10.1.48), AUDIO INPUTS/U_InputsConnectors/U_InputAmplifier (C67.1.2 R49.1.2 R53.1.2)
IN1_P: ADC1 (U10.1.47), AUDIO INPUTS/U_InputsConnectors/U_InputAmplifier (C67.1.1 R37.1.2 R42.1.2 R52.1.2)
IN2_N: ADC1 (U10.1.2), AUDIO INPUTS/U_InputsConnectors/U_InputAmplifier (C67.2.2 R49.2.2 R53.2.2)
IN2_P: ADC1 (U10.1.1), AUDIO INPUTS/U_InputsConnectors/U_InputAmplifier (C67.2.1 R37.2.2 R42.2.2 R52.2.2)
IN3_N: ADC1 (U10.1.14), AUDIO INPUTS/U_InputsConnectors/U_InputAmplifier (C67.3.2 R49.3.2 R53.3.2)
IN3_P: ADC1 (U10.1.13), AUDIO INPUTS/U_InputsConnectors/U_InputAmplifier (C67.3.1 R37.3.2 R42.3.2 R52.3.2)
IN4_N: ADC1 (U10.1.12), AUDIO INPUTS/U_InputsConnectors/U_InputAmplifier (C67.4.2 R49.4.2 R53.4.2)
IN4_P: ADC1 (U10.1.11), AUDIO INPUTS/U_InputsConnectors/U_InputAmplifier (C67.4.1 R37.4.2 R42.4.2 R52.4.2)
IN5_N: ADC1 (U10.1.46), AUDIO INPUTS/U_InputsConnectors/U_InputAmplifier (C67.5.2 R49.5.2 R53.5.2)
IN5_P: ADC1 (U10.1.45), AUDIO INPUTS/U_InputsConnectors/U_InputAmplifier (C67.5.1 R37.5.2 R42.5.2 R52.5.2)
IN6_N: ADC1 (U10.1.44), AUDIO INPUTS/U_InputsConnectors/U_InputAmplifier (C67.6.2 R49.6.2 R53.6.2)
IN6_P: ADC1 (U10.1.43), AUDIO INPUTS/U_InputsConnectors/U_InputAmplifier (C67.6.1 R37.6.2 R42.6.2 R52.6.2)
IN7_N: ADC1 (U10.1.16), AUDIO INPUTS/U_InputsConnectors/U_InputAmplifier (C67.7.2 R49.7.2 R53.7.2)
IN7_P: ADC1 (U10.1.15), AUDIO INPUTS/U_InputsConnectors/U_InputAmplifier (C67.7.1 R37.7.2 R42.7.2 R52.7.2)
IN8_N: ADC1 (U10.1.18), AUDIO INPUTS/U_InputsConnectors/U_InputAmplifier (C67.8.2 R49.8.2 R53.8.2)
IN8_P: ADC1 (U10.1.17), AUDIO INPUTS/U_InputsConnectors/U_InputAmplifier (C67.8.1 R37.8.2 R42.8.2 R52.8.2)
IN9_N: AUDIO INPUTS/U_InputsConnectors/U_InputAmplifier (C67.9.2 R49.9.2 R53.9.2), ADC2 (U10.2.48)
IN9_P: AUDIO INPUTS/U_InputsConnectors/U_InputAmplifier (C67.9.1 R37.9.2 R42.9.2 R52.9.2), ADC2 (U10.2.47)
IN10_N: AUDIO INPUTS/U_InputsConnectors/U_InputAmplifier (C67.10.2 R49.10.2 R53.10.2), ADC2 (U10.2.2)
IN10_P: AUDIO INPUTS/U_InputsConnectors/U_InputAmplifier (C67.10.1 R37.10.2 R42.10.2 R52.10.2), ADC2 (U10.2.1)
IN11_N: AUDIO INPUTS/U_InputsConnectors/U_InputAmplifier (C67.11.2 R49.11.2 R53.11.2), ADC2 (U10.2.14)
IN11_P: AUDIO INPUTS/U_InputsConnectors/U_InputAmplifier (C67.11.1 R37.11.2 R42.11.2 R52.11.2), ADC2 (U10.2.13)
IN12_N: AUDIO INPUTS/U_InputsConnectors/U_InputAmplifier (C67.12.2 R49.12.2 R53.12.2), ADC2 (U10.2.12)
IN12_P: AUDIO INPUTS/U_InputsConnectors/U_InputAmplifier (C67.12.1 R37.12.2 R42.12.2 R52.12.2), ADC2 (U10.2.11)
IN13_N: AUDIO INPUTS/U_InputsConnectors/U_InputAmplifier (C67.13.2 R49.13.2 R53.13.2), ADC2 (U10.2.46)
IN13_P: AUDIO INPUTS/U_InputsConnectors/U_InputAmplifier (C67.13.1 R37.13.2 R42.13.2 R52.13.2), ADC2 (U10.2.45)
IN14_N: AUDIO INPUTS/U_InputsConnectors/U_InputAmplifier (C67.14.2 R49.14.2 R53.14.2), ADC2 (U10.2.44)
IN14_P: AUDIO INPUTS/U_InputsConnectors/U_InputAmplifier (C67.14.1 R37.14.2 R42.14.2 R52.14.2), ADC2 (U10.2.43)
IN15_N: AUDIO INPUTS/U_InputsConnectors/U_InputAmplifier (C67.15.2 R49.15.2 R53.15.2), ADC2 (U10.2.16)
IN15_P: AUDIO INPUTS/U_InputsConnectors/U_InputAmplifier (C67.15.1 R37.15.2 R42.15.2 R52.15.2), ADC2 (U10.2.15)
IN16_N: AUDIO INPUTS/U_InputsConnectors/U_InputAmplifier (C67.16.2 R49.16.2 R53.16.2), ADC2 (U10.2.18)
IN16_P: AUDIO INPUTS/U_InputsConnectors/U_InputAmplifier (C67.16.1 R37.16.2 R42.16.2 R52.16.2), ADC2 (U10.2.17)
INT_N: XMOS_chip (U8.15), PHY_ETHERNET (R115.1 U23.38)
LRCLK: TopLevel (TP9.1 TP9.2), XMOS_chip (R25.1), ADC1 (U10.1.24), ADC2 (U10.2.24)
MCLK_AUDIO: TopLevel (R20.1 R21.2 TP7.1 TP7.2), ADC1 (U10.1.23), DAC2 (R79.1.1), DAC1 (R79.2.1), ADC2 (U10.2.23)
MCLK_XCORE: TopLevel (R20.2), XMOS_chip (U8.13 U8.63), Clock (R2.2)
NetC78.1_1: AUDIO INPUTS/U_InputsConnectors (J6.1.1), AUDIO INPUTS/U_InputsConnectors/U_InputAmplifier (C78.1.1)
NetC78.2_1: AUDIO INPUTS/U_InputsConnectors (J6.1.7), AUDIO INPUTS/U_InputsConnectors/U_InputAmplifier (C78.2.1)
NetC78.3_1: AUDIO INPUTS/U_InputsConnectors (J6.2.1), AUDIO INPUTS/U_InputsConnectors/U_InputAmplifier (C78.3.1)
NetC78.4_1: AUDIO INPUTS/U_InputsConnectors (J6.2.7), AUDIO INPUTS/U_InputsConnectors/U_InputAmplifier (C78.4.1)
NetC78.5_1: AUDIO INPUTS/U_InputsConnectors (J6.3.1), AUDIO INPUTS/U_InputsConnectors/U_InputAmplifier (C78.5.1)
NetC78.6_1: AUDIO INPUTS/U_InputsConnectors (J6.3.7), AUDIO INPUTS/U_InputsConnectors/U_InputAmplifier (C78.6.1)
NetC78.7_1: AUDIO INPUTS/U_InputsConnectors (J6.4.1), AUDIO INPUTS/U_InputsConnectors/U_InputAmplifier (C78.7.1)
NetC78.8_1: AUDIO INPUTS/U_InputsConnectors (J6.4.7), AUDIO INPUTS/U_InputsConnectors/U_InputAmplifier (C78.8.1)
NetC78.9_1: AUDIO INPUTS/U_InputsConnectors (J6.5.1), AUDIO INPUTS/U_InputsConnectors/U_InputAmplifier (C78.9.1)
NetC78.10_1: AUDIO INPUTS/U_InputsConnectors (J6.5.7), AUDIO INPUTS/U_InputsConnectors/U_InputAmplifier (C78.10.1)
NetC78.11_1: AUDIO INPUTS/U_InputsConnectors (J6.6.1), AUDIO INPUTS/U_InputsConnectors/U_InputAmplifier (C78.11.1)
NetC78.12_1: AUDIO INPUTS/U_InputsConnectors (J6.6.7), AUDIO INPUTS/U_InputsConnectors/U_InputAmplifier (C78.12.1)
NetC78.13_1: AUDIO INPUTS/U_InputsConnectors (J6.7.1), AUDIO INPUTS/U_InputsConnectors/U_InputAmplifier (C78.13.1)
NetC78.14_1: AUDIO INPUTS/U_InputsConnectors (J6.7.7), AUDIO INPUTS/U_InputsConnectors/U_InputAmplifier (C78.14.1)
NetC78.15_1: AUDIO INPUTS/U_InputsConnectors (J6.8.1), AUDIO INPUTS/U_InputsConnectors/U_InputAmplifier (C78.15.1)
NetC78.16_1: AUDIO INPUTS/U_InputsConnectors (J6.8.7), AUDIO INPUTS/U_InputsConnectors/U_InputAmplifier (C78.16.1)
NetC128.8_2: U_AudioOutputs_16/U_OutputConnectors (7 pins), StereoHeadphoneDriver (R132.2)
NetC138.8_2: U_AudioOutputs_16/U_OutputConnectors (7 pins), StereoHeadphoneDriver (R135.2)
NetD9_2: XMOS_chip (D9.2 D9.3), XMOS_power (SW1.1 SW2.1 U19.1)
NetJ6.1_2: AUDIO INPUTS/U_InputsConnectors (J6.1.2), AUDIO INPUTS/U_InputsConnectors/U_InputAmplifier (R48.1.1)
NetJ6.1_3: AUDIO INPUTS/U_InputsConnectors (J6.1.3), AUDIO INPUTS/U_InputsConnectors/U_InputAmplifier (R39.1.1)
NetJ6.1_5: AUDIO INPUTS/U_InputsConnectors (J6.1.5), AUDIO INPUTS/U_InputsConnectors/U_InputAmplifier (R39.2.1)
NetJ6.1_6: AUDIO INPUTS/U_InputsConnectors (J6.1.6), AUDIO INPUTS/U_InputsConnectors/U_InputAmplifier (R48.2.1)
NetJ6.2_2: AUDIO INPUTS/U_InputsConnectors (J6.2.2), AUDIO INPUTS/U_InputsConnectors/U_InputAmplifier (R48.3.1)
NetJ6.2_3: AUDIO INPUTS/U_InputsConnectors (J6.2.3), AUDIO INPUTS/U_InputsConnectors/U_InputAmplifier (R39.3.1)
NetJ6.2_5: AUDIO INPUTS/U_InputsConnectors (J6.2.5), AUDIO INPUTS/U_InputsConnectors/U_InputAmplifier (R39.4.1)
NetJ6.2_6: AUDIO INPUTS/U_InputsConnectors (J6.2.6), AUDIO INPUTS/U_InputsConnectors/U_InputAmplifier (R48.4.1)
NetJ6.3_2: AUDIO INPUTS/U_InputsConnectors (J6.3.2), AUDIO INPUTS/U_InputsConnectors/U_InputAmplifier (R48.5.1)
NetJ6.3_3: AUDIO INPUTS/U_InputsConnectors (J6.3.3), AUDIO INPUTS/U_InputsConnectors/U_InputAmplifier (R39.5.1)
NetJ6.3_5: AUDIO INPUTS/U_InputsConnectors (J6.3.5), AUDIO INPUTS/U_InputsConnectors/U_InputAmplifier (R39.6.1)
NetJ6.3_6: AUDIO INPUTS/U_InputsConnectors (J6.3.6), AUDIO INPUTS/U_InputsConnectors/U_InputAmplifier (R48.6.1)
NetJ6.4_2: AUDIO INPUTS/U_InputsConnectors (J6.4.2), AUDIO INPUTS/U_InputsConnectors/U_InputAmplifier (R48.7.1)
NetJ6.4_3: AUDIO INPUTS/U_InputsConnectors (J6.4.3), AUDIO INPUTS/U_InputsConnectors/U_InputAmplifier (R39.7.1)
NetJ6.4_5: AUDIO INPUTS/U_InputsConnectors (J6.4.5), AUDIO INPUTS/U_InputsConnectors/U_InputAmplifier (R39.8.1)
NetJ6.4_6: AUDIO INPUTS/U_InputsConnectors (J6.4.6), AUDIO INPUTS/U_InputsConnectors/U_InputAmplifier (R48.8.1)
NetJ6.5_2: AUDIO INPUTS/U_InputsConnectors (J6.5.2), AUDIO INPUTS/U_InputsConnectors/U_InputAmplifier (R48.9.1)
NetJ6.5_3: AUDIO INPUTS/U_InputsConnectors (J6.5.3), AUDIO INPUTS/U_InputsConnectors/U_InputAmplifier (R39.9.1)
NetJ6.5_5: AUDIO INPUTS/U_InputsConnectors (J6.5.5), AUDIO INPUTS/U_InputsConnectors/U_InputAmplifier (R39.10.1)
NetJ6.5_6: AUDIO INPUTS/U_InputsConnectors (J6.5.6), AUDIO INPUTS/U_InputsConnectors/U_InputAmplifier (R48.10.1)
NetJ6.6_2: AUDIO INPUTS/U_InputsConnectors (J6.6.2), AUDIO INPUTS/U_InputsConnectors/U_InputAmplifier (R48.11.1)
NetJ6.6_3: AUDIO INPUTS/U_InputsConnectors (J6.6.3), AUDIO INPUTS/U_InputsConnectors/U_InputAmplifier (R39.11.1)
NetJ6.6_5: AUDIO INPUTS/U_InputsConnectors (J6.6.5), AUDIO INPUTS/U_InputsConnectors/U_InputAmplifier (R39.12.1)
NetJ6.6_6: AUDIO INPUTS/U_InputsConnectors (J6.6.6), AUDIO INPUTS/U_InputsConnectors/U_InputAmplifier (R48.12.1)
NetJ6.7_2: AUDIO INPUTS/U_InputsConnectors (J6.7.2), AUDIO INPUTS/U_InputsConnectors/U_InputAmplifier (R48.13.1)
NetJ6.7_3: AUDIO INPUTS/U_InputsConnectors (J6.7.3), AUDIO INPUTS/U_InputsConnectors/U_InputAmplifier (R39.13.1)
NetJ6.7_5: AUDIO INPUTS/U_InputsConnectors (J6.7.5), AUDIO INPUTS/U_InputsConnectors/U_InputAmplifier (R39.14.1)
NetJ6.7_6: AUDIO INPUTS/U_InputsConnectors (J6.7.6), AUDIO INPUTS/U_InputsConnectors/U_InputAmplifier (R48.14.1)
NetJ6.8_2: AUDIO INPUTS/U_InputsConnectors (J6.8.2), AUDIO INPUTS/U_InputsConnectors/U_InputAmplifier (R48.15.1)
NetJ6.8_3: AUDIO INPUTS/U_InputsConnectors (J6.8.3), AUDIO INPUTS/U_InputsConnectors/U_InputAmplifier (R39.15.1)
NetJ6.8_5: AUDIO INPUTS/U_InputsConnectors (J6.8.5), AUDIO INPUTS/U_InputsConnectors/U_InputAmplifier (R39.16.1)
NetJ6.8_6: AUDIO INPUTS/U_InputsConnectors (J6.8.6), AUDIO INPUTS/U_InputsConnectors/U_InputAmplifier (R48.16.1)
NetR1_2: XMOS_chip (U8.125), Clock (R1.2)
NetR21_1: TopLevel (R21.1), XMOS_chip (U8.93)
NetR31.1_2: TopLevel (TP10.1 TP10.2), XMOS_chip (U8.96), ADC1 (R31.1.2 U10.1.36), ADC2 (R31.2.2 U10.2.36)
NetR62.1_1: AudioInputs_16 (U11.2), AUDIO INPUTS/U_InputsConnectors/U_InputAmplifier (R62.1.1)
NetR62.2_1: AudioInputs_16 (U11.9), AUDIO INPUTS/U_InputsConnectors/U_InputAmplifier (R62.2.1)
NetR62.3_1: AudioInputs_16 (U11.5), AUDIO INPUTS/U_InputsConnectors/U_InputAmplifier (R62.3.1)
NetR62.4_1: AudioInputs_16 (U11.12), AUDIO INPUTS/U_InputsConnectors/U_InputAmplifier (R62.4.1)
NetR62.5_1: AudioInputs_16 (U13.2), AUDIO INPUTS/U_InputsConnectors/U_InputAmplifier (R62.5.1)
NetR62.6_1: AudioInputs_16 (U13.9), AUDIO INPUTS/U_InputsConnectors/U_InputAmplifier (R62.6.1)
NetR62.7_1: AudioInputs_16 (U13.5), AUDIO INPUTS/U_InputsConnectors/U_InputAmplifier (R62.7.1)
NetR62.8_1: AudioInputs_16 (U13.12), AUDIO INPUTS/U_InputsConnectors/U_InputAmplifier (R62.8.1)
NetR62.9_1: AudioInputs_16 (U12.2), AUDIO INPUTS/U_InputsConnectors/U_InputAmplifier (R62.9.1)
NetR62.10_1: AudioInputs_16 (U12.9), AUDIO INPUTS/U_InputsConnectors/U_InputAmplifier (R62.10.1)
NetR62.11_1: AudioInputs_16 (U12.5), AUDIO INPUTS/U_InputsConnectors/U_InputAmplifier (R62.11.1)
NetR62.12_1: AudioInputs_16 (U12.12), AUDIO INPUTS/U_InputsConnectors/U_InputAmplifier (R62.12.1)
NetR62.13_1: AudioInputs_16 (U14.2), AUDIO INPUTS/U_InputsConnectors/U_InputAmplifier (R62.13.1)
NetR62.14_1: AudioInputs_16 (U14.9), AUDIO INPUTS/U_InputsConnectors/U_InputAmplifier (R62.14.1)
NetR62.15_1: AudioInputs_16 (U14.5), AUDIO INPUTS/U_InputsConnectors/U_InputAmplifier (R62.15.1)
NetR62.16_1: AudioInputs_16 (U14.12), AUDIO INPUTS/U_InputsConnectors/U_InputAmplifier (R62.16.1)
NetR63.1_2: AudioInputs_16 (U11.4), AUDIO INPUTS/U_InputsConnectors/U_InputAmplifier (R63.1.2)
NetR63.2_2: AudioInputs_16 (U11.11), AUDIO INPUTS/U_InputsConnectors/U_InputAmplifier (R63.2.2)
NetR63.3_2: AudioInputs_16 (U11.7), AUDIO INPUTS/U_InputsConnectors/U_InputAmplifier (R63.3.2)
NetR63.4_2: AudioInputs_16 (U11.14), AUDIO INPUTS/U_InputsConnectors/U_InputAmplifier (R63.4.2)
NetR63.5_2: AudioInputs_16 (U13.4), AUDIO INPUTS/U_InputsConnectors/U_InputAmplifier (R63.5.2)
NetR63.6_2: AudioInputs_16 (U13.11), AUDIO INPUTS/U_InputsConnectors/U_InputAmplifier (R63.6.2)
NetR63.7_2: AudioInputs_16 (U13.7), AUDIO INPUTS/U_InputsConnectors/U_InputAmplifier (R63.7.2)
NetR63.8_2: AudioInputs_16 (U13.14), AUDIO INPUTS/U_InputsConnectors/U_InputAmplifier (R63.8.2)
NetR63.9_2: AudioInputs_16 (U12.4), AUDIO INPUTS/U_InputsConnectors/U_InputAmplifier (R63.9.2)
NetR63.10_2: AudioInputs_16 (U12.11), AUDIO INPUTS/U_InputsConnectors/U_InputAmplifier (R63.10.2)
NetR63.11_2: AudioInputs_16 (U12.7), AUDIO INPUTS/U_InputsConnectors/U_InputAmplifier (R63.11.2)
NetR63.12_2: AudioInputs_16 (U12.14), AUDIO INPUTS/U_InputsConnectors/U_InputAmplifier (R63.12.2)
NetR63.13_2: AudioInputs_16 (U14.4), AUDIO INPUTS/U_InputsConnectors/U_InputAmplifier (R63.13.2)
NetR63.14_2: AudioInputs_16 (U14.11), AUDIO INPUTS/U_InputsConnectors/U_InputAmplifier (R63.14.2)
NetR63.15_2: AudioInputs_16 (U14.7), AUDIO INPUTS/U_InputsConnectors/U_InputAmplifier (R63.15.2)
NetR63.16_2: AudioInputs_16 (U14.14), AUDIO INPUTS/U_InputsConnectors/U_InputAmplifier (R63.16.2)
NetR140_1: XMOS_chip (U8.70), U_LEDs_I2C_PORT (R140.1)
NetR141_1: XMOS_chip (U8.71), U_LEDs_I2C_PORT (R141.1)
NetR142_1: XMOS_chip (U8.69), U_LEDs_I2C_PORT (R142.1)
NetTP6_1: TopLevel (TP6.1 TP6.2), XMOS_chip (U8.95), ADC1 (U10.1.41), ADC2 (U10.2.41)
NetU1_5: XMOS_chip (U8.30), Clock (U1.5)
NetU8_94: XMOS_chip (U8.94), DAC2 (U21.1.19), DAC1 (U21.2.19)
PHANTOM1_U_InputsConnectors: AUDIO INPUTS/U_InputsConnectors (J7.1.1), AUDIO INPUTS/U_InputsConnectors/U_InputAmplifier (R41.1.2 R47.1.1)
PHANTOM1_U_InputsConnectors: AUDIO INPUTS/U_InputsConnectors (J7.2.1), AUDIO INPUTS/U_InputsConnectors/U_InputAmplifier (R41.3.2 R47.3.1)
PHANTOM1_U_InputsConnectors: AUDIO INPUTS/U_InputsConnectors (J7.3.1), AUDIO INPUTS/U_InputsConnectors/U_InputAmplifier (R41.5.2 R47.5.1)
PHANTOM1_U_InputsConnectors: AUDIO INPUTS/U_InputsConnectors (J7.4.1), AUDIO INPUTS/U_InputsConnectors/U_InputAmplifier (R41.7.2 R47.7.1)
PHANTOM1_U_InputsConnectors: AUDIO INPUTS/U_InputsConnectors (J7.5.1), AUDIO INPUTS/U_InputsConnectors/U_InputAmplifier (R41.9.2 R47.9.1)
PHANTOM1_U_InputsConnectors: AUDIO INPUTS/U_InputsConnectors (J7.6.1), AUDIO INPUTS/U_InputsConnectors/U_InputAmplifier (R41.11.2 R47.11.1)
PHANTOM1_U_InputsConnectors: AUDIO INPUTS/U_InputsConnectors (J7.7.1), AUDIO INPUTS/U_InputsConnectors/U_InputAmplifier (R41.13.2 R47.13.1)
PHANTOM1_U_InputsConnectors: AUDIO INPUTS/U_InputsConnectors (J7.8.1), AUDIO INPUTS/U_InputsConnectors/U_InputAmplifier (R41.15.2 R47.15.1)
PHANTOM2_U_InputsConnectors: AUDIO INPUTS/U_InputsConnectors (J7.1.2), AUDIO INPUTS/U_InputsConnectors/U_InputAmplifier (R41.2.2 R47.2.1)
PHANTOM2_U_InputsConnectors: AUDIO INPUTS/U_InputsConnectors (J7.2.2), AUDIO INPUTS/U_InputsConnectors/U_InputAmplifier (R41.4.2 R47.4.1)
PHANTOM2_U_InputsConnectors: AUDIO INPUTS/U_InputsConnectors (J7.3.2), AUDIO INPUTS/U_InputsConnectors/U_InputAmplifier (R41.6.2 R47.6.1)
PHANTOM2_U_InputsConnectors: AUDIO INPUTS/U_InputsConnectors (J7.4.2), AUDIO INPUTS/U_InputsConnectors/U_InputAmplifier (R41.8.2 R47.8.1)
PHANTOM2_U_InputsConnectors: AUDIO INPUTS/U_InputsConnectors (J7.5.2), AUDIO INPUTS/U_InputsConnectors/U_InputAmplifier (R41.10.2 R47.10.1)
PHANTOM2_U_InputsConnectors: AUDIO INPUTS/U_InputsConnectors (J7.6.2), AUDIO INPUTS/U_InputsConnectors/U_InputAmplifier (R41.12.2 R47.12.1)
PHANTOM2_U_InputsConnectors: AUDIO INPUTS/U_InputsConnectors (J7.7.2), AUDIO INPUTS/U_InputsConnectors/U_InputAmplifier (R41.14.2 R47.14.1)
PHANTOM2_U_InputsConnectors: AUDIO INPUTS/U_InputsConnectors (J7.8.2), AUDIO INPUTS/U_InputsConnectors/U_InputAmplifier (R41.16.2 R47.16.1)
PHY_MDC: XMOS_chip (U8.122), PHY_ETHERNET (U23.36)
PHY_MDIO: XMOS_chip (U8.121), PHY_ETHERNET (U23.37)
PHY_RESET_N: XMOS_chip (U8.18), PHY_ETHERNET (D18.K)
PHY_RX0: XMOS_chip (U8.116), PHY_ETHERNET (R114.2 R118.1)
PHY_RX1: XMOS_chip (U8.117), PHY_ETHERNET (R113.2 R119.1)
PHY_RX2: XMOS_chip (U8.118), PHY_ETHERNET (R112.2 R121.1)
PHY_RX3: XMOS_chip (U8.119), PHY_ETHERNET (R111.2 R122.1)
PHY_RX_CLK: XMOS_chip (U8.114), PHY_ETHERNET (R116.1 R125.1)
PHY_RX_DV: XMOS_chip (U8.115), PHY_ETHERNET (R117.1)
PHY_TX_CLK: XMOS_chip (U8.112), PHY_ETHERNET (U23.24)
PHY_TX_D0: XMOS_chip (U8.109), PHY_ETHERNET (U23.19)
PHY_TX_D1: XMOS_chip (U8.108), PHY_ETHERNET (U23.20)
PHY_TX_D3: XMOS_chip (U8.106), PHY_ETHERNET (U23.22)
PHY_TX_EN: XMOS_chip (U8.113), PHY_ETHERNET (U23.25)
PHY_TXD2: XMOS_chip (U8.107), PHY_ETHERNET (U23.21)
SCLK: TopLevel (TP8.1 TP8.2), XMOS_chip (R26.1), ADC1 (U10.1.25), ADC2 (U10.2.25)
V1: AudioInputs_16 (U11.3), AUDIO INPUTS/U_InputsConnectors/U_InputAmplifier (C76.1.2 R56.1.1 U16.1.7)
V1: AudioInputs_16 (U11.6), AUDIO INPUTS/U_InputsConnectors/U_InputAmplifier (C76.3.2 R56.3.1 U16.3.7)
V1: AudioInputs_16 (U11.10), AUDIO INPUTS/U_InputsConnectors/U_InputAmplifier (C76.2.2 R56.2.1 U16.2.7)
V1: AudioInputs_16 (U11.13), AUDIO INPUTS/U_InputsConnectors/U_InputAmplifier (C76.4.2 R56.4.1 U16.4.7)
V1: AudioInputs_16 (U13.3), AUDIO INPUTS/U_InputsConnectors/U_InputAmplifier (C76.5.2 R56.5.1 U16.5.7)
V1: AudioInputs_16 (U13.6), AUDIO INPUTS/U_InputsConnectors/U_InputAmplifier (C76.7.2 R56.7.1 U16.7.7)
V1: AudioInputs_16 (U13.10), AUDIO INPUTS/U_InputsConnectors/U_InputAmplifier (C76.6.2 R56.6.1 U16.6.7)
V1: AudioInputs_16 (U13.13), AUDIO INPUTS/U_InputsConnectors/U_InputAmplifier (C76.8.2 R56.8.1 U16.8.7)
V1: AudioInputs_16 (U12.3), AUDIO INPUTS/U_InputsConnectors/U_InputAmplifier (C76.9.2 R56.9.1 U16.9.7)
V1: AudioInputs_16 (U12.6), AUDIO INPUTS/U_InputsConnectors/U_InputAmplifier (C76.11.2 R56.11.1 U16.11.7)
V1: AudioInputs_16 (U12.10), AUDIO INPUTS/U_InputsConnectors/U_InputAmplifier (C76.10.2 R56.10.1 U16.10.7)
V1: AudioInputs_16 (U12.13), AUDIO INPUTS/U_InputsConnectors/U_InputAmplifier (C76.12.2 R56.12.1 U16.12.7)
V1: AudioInputs_16 (U14.3), AUDIO INPUTS/U_InputsConnectors/U_InputAmplifier (C76.13.2 R56.13.1 U16.13.7)
V1: AudioInputs_16 (U14.6), AUDIO INPUTS/U_InputsConnectors/U_InputAmplifier (C76.15.2 R56.15.1 U16.15.7)
V1: AudioInputs_16 (U14.10), AUDIO INPUTS/U_InputsConnectors/U_InputAmplifier (C76.14.2 R56.14.1 U16.14.7)
V1: AudioInputs_16 (U14.13), AUDIO INPUTS/U_InputsConnectors/U_InputAmplifier (C76.16.2 R56.16.1 U16.16.7)